# Altium schematic sheet sterownik.SchDoc: Sterownik panelu
size A4; Author: Jakub Wiczynski; Revision: 1
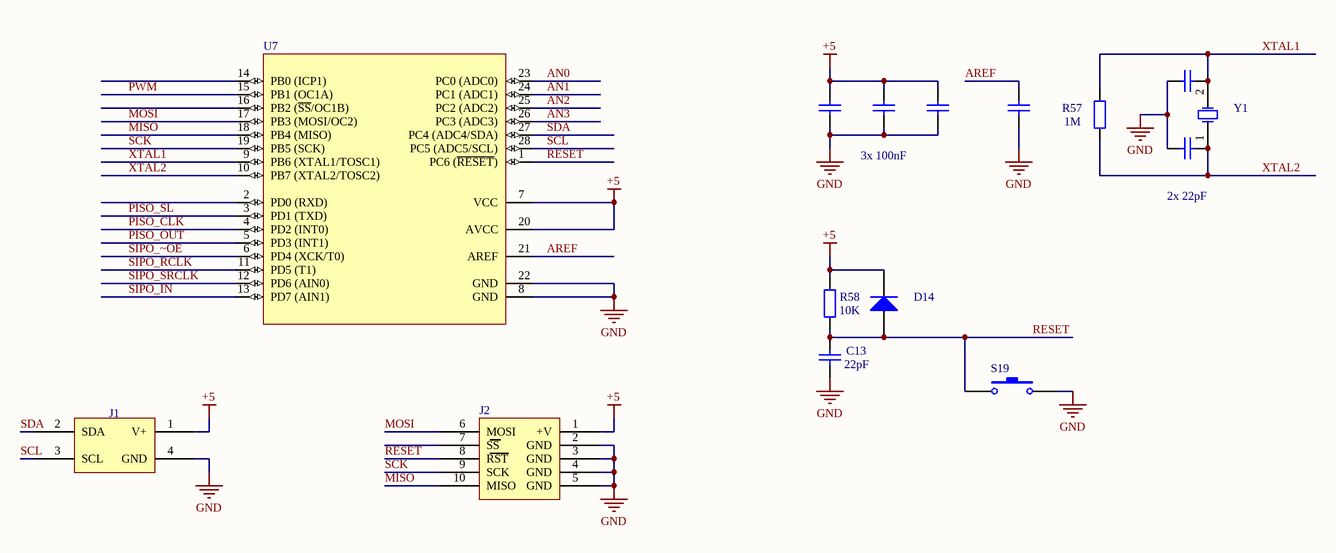
[diagram p0: sterownik.SchDoc]

## Parts
C7  http://www.tme.eu/pl/details/12061c104kat2a/kondensatory-mlcc-smd-1206/avx/  [C1206]  (value not drawn)
C8  http://www.tme.eu/pl/details/12061c104kat2a/kondensatory-mlcc-smd-1206/avx/  [C1206]  (value not drawn)
C9  http://www.tme.eu/pl/details/12061c104kat2a/kondensatory-mlcc-smd-1206/avx/  [C1206]  (value not drawn)
C10  http://www.tme.eu/pl/details/12061c104kat2a/kondensatory-mlcc-smd-1206/avx/  [C1206]  (value not drawn)
C11  http://www.tme.eu/pl/details/cl31c220jbcnnnc/kondensatory-mlcc-smd-1206/samsung/  [C1206]  (value not drawn)
C12  http://www.tme.eu/pl/details/cl31c220jbcnnnc/kondensatory-mlcc-smd-1206/samsung/  [C1206]  (value not drawn)
C13  value 22pF  [C1206]  (hidden comment: http://www.tme.eu/pl/details/cl31c220jbcnnnc/kondensatory-mlcc-smd-1206/samsung/)
D14  http://www.tme.eu/pl/details/1n4148-1206/diody-uniwersalne-smd/dc-components/cd4148w1206c/  [DIODA 1N4148]  (value not drawn)
J1  http://www.tme.eu/pl/details/p1304/zlacza-idc/tomic/  [IDC 4PIN]  (value not drawn)
J2  http://www.tme.eu/pl/details/09185106324/zlacza-idc/harting/  [IDC 10PIN]  (value not drawn)
R57  value 1M  [C1206]  (hidden comment: http://www.tme.eu/pl/details/rc1206fr-071m/rezystory-smd-1206/yageo/rc1206fr-071ml/)
R58  value 10K  [C1206]  (hidden comment: http://www.tme.eu/pl/details/crcw120610k0jntabc/rezystory-smd-1206/vishay/)
S19  http://www.tme.eu/pl/details/1301.9315/mikroprzelaczniki-tact-pcb/schurter/  [Microswitch_SMD]  (value not drawn)
U7  http://www.tme.eu/pl/details/atmega8a-au/mikrokontrolery-atmel-avr-smd/atmel/  [32A_N]  (value not drawn)
Y1  http://www.tme.eu/pl/details/16.00m-smdhc49s-ht/rezonatory-kwarcowe-smd/yic/16mhz-_105c-49smd-on-tape/  [crystal]  (value not drawn)

## Nets
+5: C7.2 C8.2 C9.2 D14.2(K) J1.1(V+) J2.1(+V) R58.2 U7.7(VCC) U7.20(AVCC)
GND: C7.1 C8.1 C9.1 C10.2 C11.1 C12.1 C13.1 J1.4(GND) J2.2(GND) J2.3(GND) J2.4(GND) J2.5(GND) S19.2 U7.8(GND) U7.22(GND)
AN0: U7.23(PC0_(ADC0))
AN1: U7.24(PC1_(ADC1))
AN2: U7.25(PC2_(ADC2))
AN3: U7.26(PC3_(ADC3))
AREF: C10.1 U7.21(AREF)
MISO: J2.10(MISO) U7.18(PB4_(MISO))
MOSI: J2.6(MOSI) U7.17(PB3_(MOSI/OC2))
PISO_CLK: U7.4(PD2_(INT0))
PISO_OUT: U7.5(PD3_(INT1))
PISO_SL: U7.3(PD1_(TXD))
PWM: U7.15(PB1_(OC1A))
RESET: C13.2 D14.1(A) J2.8(RST) R58.1 S19.1 U7.1(PC6_(~{RESET}))
SCK: J2.9(SCK) U7.19(PB5_(SCK))
SCL: J1.3(SCL) U7.28(PC5_(ADC5/SCL))
SDA: J1.2(SDA) U7.27(PC4_(ADC4/SDA))
SIPO_IN: U7.13(PD7_(AIN1))
SIPO_RCLK: U7.11(PD5_(T1))
SIPO_SRCLK: U7.12(PD6_(AIN0))
SIPO_~OE: U7.6(PD4_(XCK/T0))
XTAL1: C11.2 R57.2 U7.9(PB6_(XTAL1/TOSC1)) Y1.2(OSC2)
XTAL2: C12.2 R57.1 U7.10(PB7_(XTAL2/TOSC2)) Y1.1(OSC1)

Not connected (* = marked no-connect by the designer): J2 7(SS); U7 2(PD0_(RXD)) 14(PB0_(ICP1)) 16(PB2_(~{SS}/OC1B))

## Notes on the sheet
- 3x 100nF
- (near C12) 2x 22pF
- Title:
- Author:
- Approved by:
- Size:
- A4
- Date:
- Revision:

## Library data of the parts
C7-C10 = Cap: 100nF; Published: 8-Jun-2000; LatestRevisionDate: 17-Jul-2002; LatestRevisionNote: Re-released for DXP Platform.; PackageReference: RAD-0.3; Publisher: Altium Limited; PackageDescription: Radial Cap, Thru-Hole; 2 Leads; 0.3 in Pin Spacing; Value: 100nF
C11-C13 = Cap: 22pF; Published: 8-Jun-2000; LatestRevisionDate: 17-Jul-2002; LatestRevisionNote: Re-released for DXP Platform.; PackageReference: RAD-0.3; Publisher: Altium Limited; PackageDescription: Radial Cap, Thru-Hole; 2 Leads; 0.3 in Pin Spacing
  C11 C12: Value: 22pF
D14 = Diode 1N4148: Dioda 1N4148; Published: 8-Jun-2000; LatestRevisionDate: 17-Jul-2002; LatestRevisionNote: Re-released for DXP Platform.; DatasheetVersion: 1997; PackageReference: DO-35; Publisher: Altium Limited; PackageDescription: Diode, Axial; Body 3.8 x 1.9 mm (LxDia. max), Lead Dia. 0.53 mm (max); Code_JEDEC: DO-204-AH; ComponentLink1Description: Manufacturer Link; ComponentLink1URL: http://www.fairchildsemi.com/; ComponentLink2Description: Datasheet; ComponentLink2URL: http://www.fairchildsemi.com/ds/1N%2F1N4148.pdf
J1 = I2C: Gniazdo IDC 4PIN
J2 = SPI: Gniazdo IDC 10PIN
R57 = Res2: 1M; Published: 8-Jun-2000; LatestRevisionDate: 17-Jul-2002; LatestRevisionNote: Re-released for DXP Platform.; PackageReference: AXIAL-0.4; Publisher: Altium Limited; PackageDescription: Axial Device, Thru-Hole; 2 Leads; 0.4 in Pin Spacing
R58 = Res2: 10K; Published: 8-Jun-2000; LatestRevisionDate: 17-Jul-2002; LatestRevisionNote: Re-released for DXP Platform.; PackageReference: AXIAL-0.4; Publisher: Altium Limited; PackageDescription: Axial Device, Thru-Hole; 2 Leads; 0.4 in Pin Spacing
S19 = SW-PB: Microswitch (SPST); pin to pad: 1>0 2>1; Published: 24-Mar-1999; LatestRevisionDate: 17-Jul-2002; LatestRevisionNote: Re-released for DXP Platform.; PackageReference: SPST-2; Publisher: Altium Limited; PackageDescription: Switch; 2 Leads
U7 = ATmega8A-PU: Atmega 8A-PU; DatasheetVersion: revD, Feb-2011; PackageVersion: revB, Sep-2001; PackageReference: 28P3; PackageDescription: 28-lead (0.300"/7.62mm Wide) Plastic Dual Inline Package (PDIP); ComponentLink1Description: Manufacturer URL; ComponentLink1URL: http://www.atmel.com/; ComponentLink2Description: ATmega8A Datasheet; ComponentLink2URL: http://www.atmel.com/dyn/resources/prod_documents/doc8159.pdf; ComponentLink3Description: ATmega8A Summary; ComponentLink3URL: http://www.atmel.com/dyn/resources/prod_documents/8159S.pdf
Y1 = XTAL: Kwarc 16MHz; Published: 8-Jun-2000; LatestRevisionDate: 17-Jul-2002; LatestRevisionNote: Re-released for DXP Platform.; PackageReference: R38; Publisher: Altium Limited; PackageDescription: Crystal, Thru-Hole; 2 Leads; Body 3.1 x 8.2 mm (Dia.xH)